# Altium schematic sheet top_title_toc.SchDoc
size OrCAD B; DocumentNumber: 1; SheetNumber: 1; SheetTotal: 3
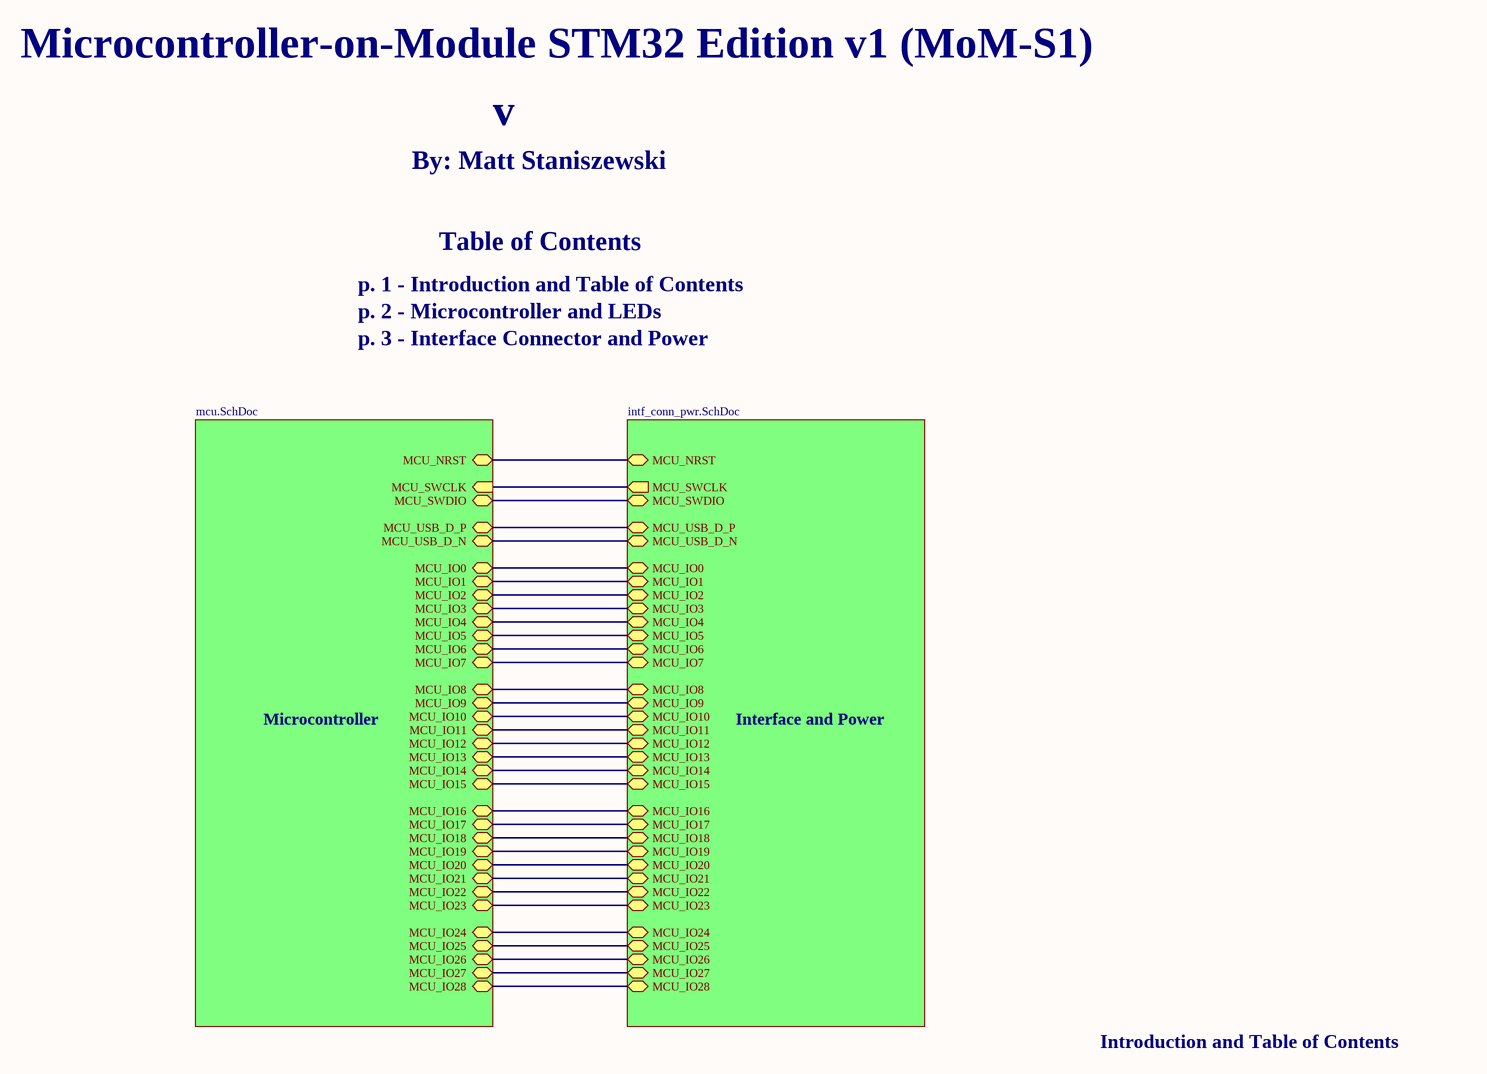
[diagram p0: top_title_toc.SchDoc]

## Sub-sheets
Interface and Power = intf_conn_pwr.SchDoc: MCU_NRST (bidir), MCU_USB_D_P (bidir), MCU_USB_D_N (bidir), MCU_SWCLK (out), MCU_SWDIO (bidir), MCU_IO28 (bidir), MCU_IO27 (bidir), MCU_IO26 (bidir), MCU_IO25 (bidir), MCU_IO24 (bidir), MCU_IO23 (bidir), MCU_IO22 (bidir), MCU_IO21 (bidir), MCU_IO20 (bidir), MCU_IO19 (bidir), MCU_IO4 (bidir), MCU_IO5 (bidir), MCU_IO3 (bidir), MCU_IO2 (bidir), MCU_IO1 (bidir), MCU_IO0 (bidir), MCU_IO8 (bidir), MCU_IO11 (bidir), MCU_IO12 (bidir), MCU_IO13 (bidir), MCU_IO9 (bidir), MCU_IO10 (bidir), MCU_IO14 (bidir), MCU_IO15 (bidir), MCU_IO16 (bidir), MCU_IO17 (bidir), MCU_IO18 (bidir), MCU_IO7 (bidir), MCU_IO6 (bidir)
Microcontroller = mcu.SchDoc: MCU_USB_D_P (bidir), MCU_USB_D_N (bidir), MCU_SWCLK (in), MCU_SWDIO (bidir), MCU_IO28 (bidir), MCU_IO26 (bidir), MCU_IO24 (bidir), MCU_IO27 (bidir), MCU_IO21 (bidir), MCU_IO22 (bidir), MCU_IO25 (bidir), MCU_IO23 (bidir), MCU_IO17 (bidir), MCU_IO18 (bidir), MCU_IO15 (bidir), MCU_IO14 (bidir), MCU_IO10 (bidir), MCU_IO9 (bidir), MCU_IO16 (bidir), MCU_IO13 (bidir), MCU_IO20 (bidir), MCU_IO7 (bidir), MCU_IO12 (bidir), MCU_IO19 (bidir), MCU_IO8 (bidir), MCU_IO11 (bidir), MCU_IO6 (bidir), MCU_IO4 (bidir), MCU_IO1 (bidir), MCU_IO3 (bidir), MCU_IO5 (bidir), MCU_IO0 (bidir), MCU_IO2 (bidir), MCU_NRST (bidir)

## Nets
(unnamed): sheet Microcontroller/MCU_USB_D_P, sheet Interface and Power/MCU_USB_D_P
(unnamed): sheet Microcontroller/MCU_USB_D_N, sheet Interface and Power/MCU_USB_D_N
(unnamed): sheet Microcontroller/MCU_SWCLK, sheet Interface and Power/MCU_SWCLK
(unnamed): sheet Microcontroller/MCU_SWDIO, sheet Interface and Power/MCU_SWDIO
(unnamed): sheet Microcontroller/MCU_IO28, sheet Interface and Power/MCU_IO28
(unnamed): sheet Microcontroller/MCU_IO26, sheet Interface and Power/MCU_IO26
(unnamed): sheet Microcontroller/MCU_IO24, sheet Interface and Power/MCU_IO24
(unnamed): sheet Microcontroller/MCU_IO27, sheet Interface and Power/MCU_IO27
(unnamed): sheet Microcontroller/MCU_IO21, sheet Interface and Power/MCU_IO21
(unnamed): sheet Microcontroller/MCU_IO22, sheet Interface and Power/MCU_IO22
(unnamed): sheet Microcontroller/MCU_IO25, sheet Interface and Power/MCU_IO25
(unnamed): sheet Microcontroller/MCU_IO23, sheet Interface and Power/MCU_IO23
(unnamed): sheet Microcontroller/MCU_IO17, sheet Interface and Power/MCU_IO17
(unnamed): sheet Microcontroller/MCU_IO18, sheet Interface and Power/MCU_IO18
(unnamed): sheet Microcontroller/MCU_IO15, sheet Interface and Power/MCU_IO15
(unnamed): sheet Microcontroller/MCU_IO14, sheet Interface and Power/MCU_IO14
(unnamed): sheet Microcontroller/MCU_IO10, sheet Interface and Power/MCU_IO10
(unnamed): sheet Microcontroller/MCU_IO9, sheet Interface and Power/MCU_IO9
(unnamed): sheet Microcontroller/MCU_IO16, sheet Interface and Power/MCU_IO16
(unnamed): sheet Microcontroller/MCU_IO13, sheet Interface and Power/MCU_IO13
(unnamed): sheet Microcontroller/MCU_IO20, sheet Interface and Power/MCU_IO20
(unnamed): sheet Microcontroller/MCU_IO7, sheet Interface and Power/MCU_IO7
(unnamed): sheet Microcontroller/MCU_IO12, sheet Interface and Power/MCU_IO12
(unnamed): sheet Microcontroller/MCU_IO19, sheet Interface and Power/MCU_IO19
(unnamed): sheet Microcontroller/MCU_IO8, sheet Interface and Power/MCU_IO8
(unnamed): sheet Microcontroller/MCU_IO11, sheet Interface and Power/MCU_IO11
(unnamed): sheet Microcontroller/MCU_IO6, sheet Interface and Power/MCU_IO6
(unnamed): sheet Microcontroller/MCU_IO4, sheet Interface and Power/MCU_IO4
(unnamed): sheet Microcontroller/MCU_IO1, sheet Interface and Power/MCU_IO1
(unnamed): sheet Microcontroller/MCU_IO3, sheet Interface and Power/MCU_IO3
(unnamed): sheet Microcontroller/MCU_IO5, sheet Interface and Power/MCU_IO5
(unnamed): sheet Microcontroller/MCU_IO0, sheet Interface and Power/MCU_IO0
(unnamed): sheet Microcontroller/MCU_IO2, sheet Interface and Power/MCU_IO2
(unnamed): sheet Microcontroller/MCU_NRST, sheet Interface and Power/MCU_NRST

## Notes on the sheet
- Microcontroller-on-Module STM32 Edition v1 (MoM-S1)
- By: Matt Staniszewski
- v
- p. 1 - Introduction and Table of Contents
- Table of Contents
- p. 2 - Microcontroller and LEDs
- p. 3 - Interface Connector and Power
- Introduction and Table of Contents